# Altium schematic sheet MCU.SchDoc
size A4; SheetNumber: 1; SheetTotal: 2
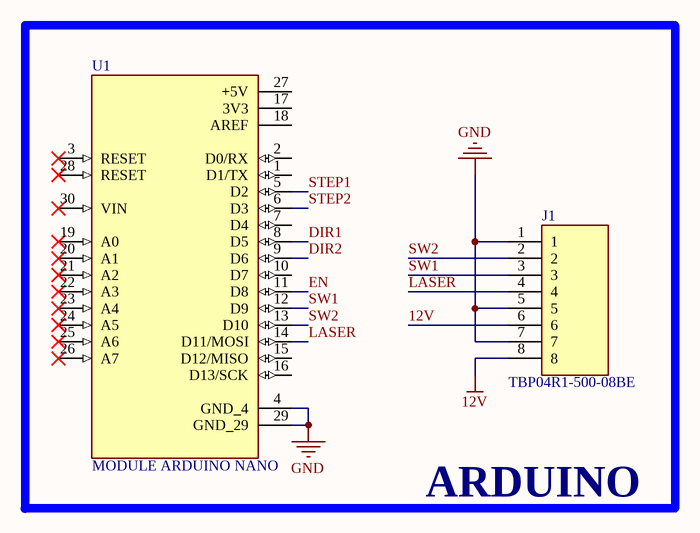
[diagram p0: MCU.SchDoc]

## Parts
J1  TBP04R1-500-08BE  [TBP04R1-500-08BE]
U1  MODULE ARDUINO NANO  [MODULE ARDUINO NANO]

## Blocks framed on the sheet
ARDUINO: J1 U1

## Nets
12V: J1.6 J1.8
GND: J1.1 J1.5 J1.7 U1.4(GND_4) U1.29(GND_29)
DIR1: U1.8(D5)
DIR2: U1.9(D6)
EN: U1.11(D8)
LASER: J1.4 U1.14(D11/MOSI)
STEP1: U1.5(D2)
STEP2: U1.6(D3)
SW1: J1.3 U1.12(D9)
SW2: J1.2 U1.13(D10)

Not connected (* = marked no-connect by the designer): U1 1(D1/TX) 2(D0/RX) 3(RESET)* 7(D4) 10(D7) 15(D12/MISO) 16(D13/SCK) 17(3V3) 18(AREF) 19(A0)* 20(A1)* 21(A2)* 22(A3)* 23(A4)* 24(A5)* 25(A6)* 26(A7)* 27(+5V) 28(RESET)* 30(VIN)*

## Library data of the parts
J1 = TBP04R1-500-08BE: 2~24 Poles, Pluggable, Receptacle, Horizontal, 5.0 Pitch, Terminal Block Connector; MF: Same Sky; SnapEDA_Link: https://www.snapeda.com/parts/TBP04R1-500-08BE/Same+Sky/view-part/?ref=snap; Package: None; Value: *; MP: TBP04R1-500-08BE; Check_prices: https://www.snapeda.com/parts/TBP04R1-500-08BE/Same+Sky/view-part/?ref=eda
U1 = MODULE ARDUINO NANO: Small, complete, and breadboard-friendly board based on the ATmega328 (Arduino Nano 3.x); SnapEDA_Link: https://www.snapeda.com/parts/Arduino%20Nano/Arduino/view-part/?ref=snap; Package: Non-Standard Arduino; Value: *; MF: Arduino; MP: Arduino Nano; Check_prices: https://www.snapeda.com/parts/Arduino%20Nano/Arduino/view-part/?ref=eda